# EAGLE design 3002_arduino (EAGLE 9.6.2)
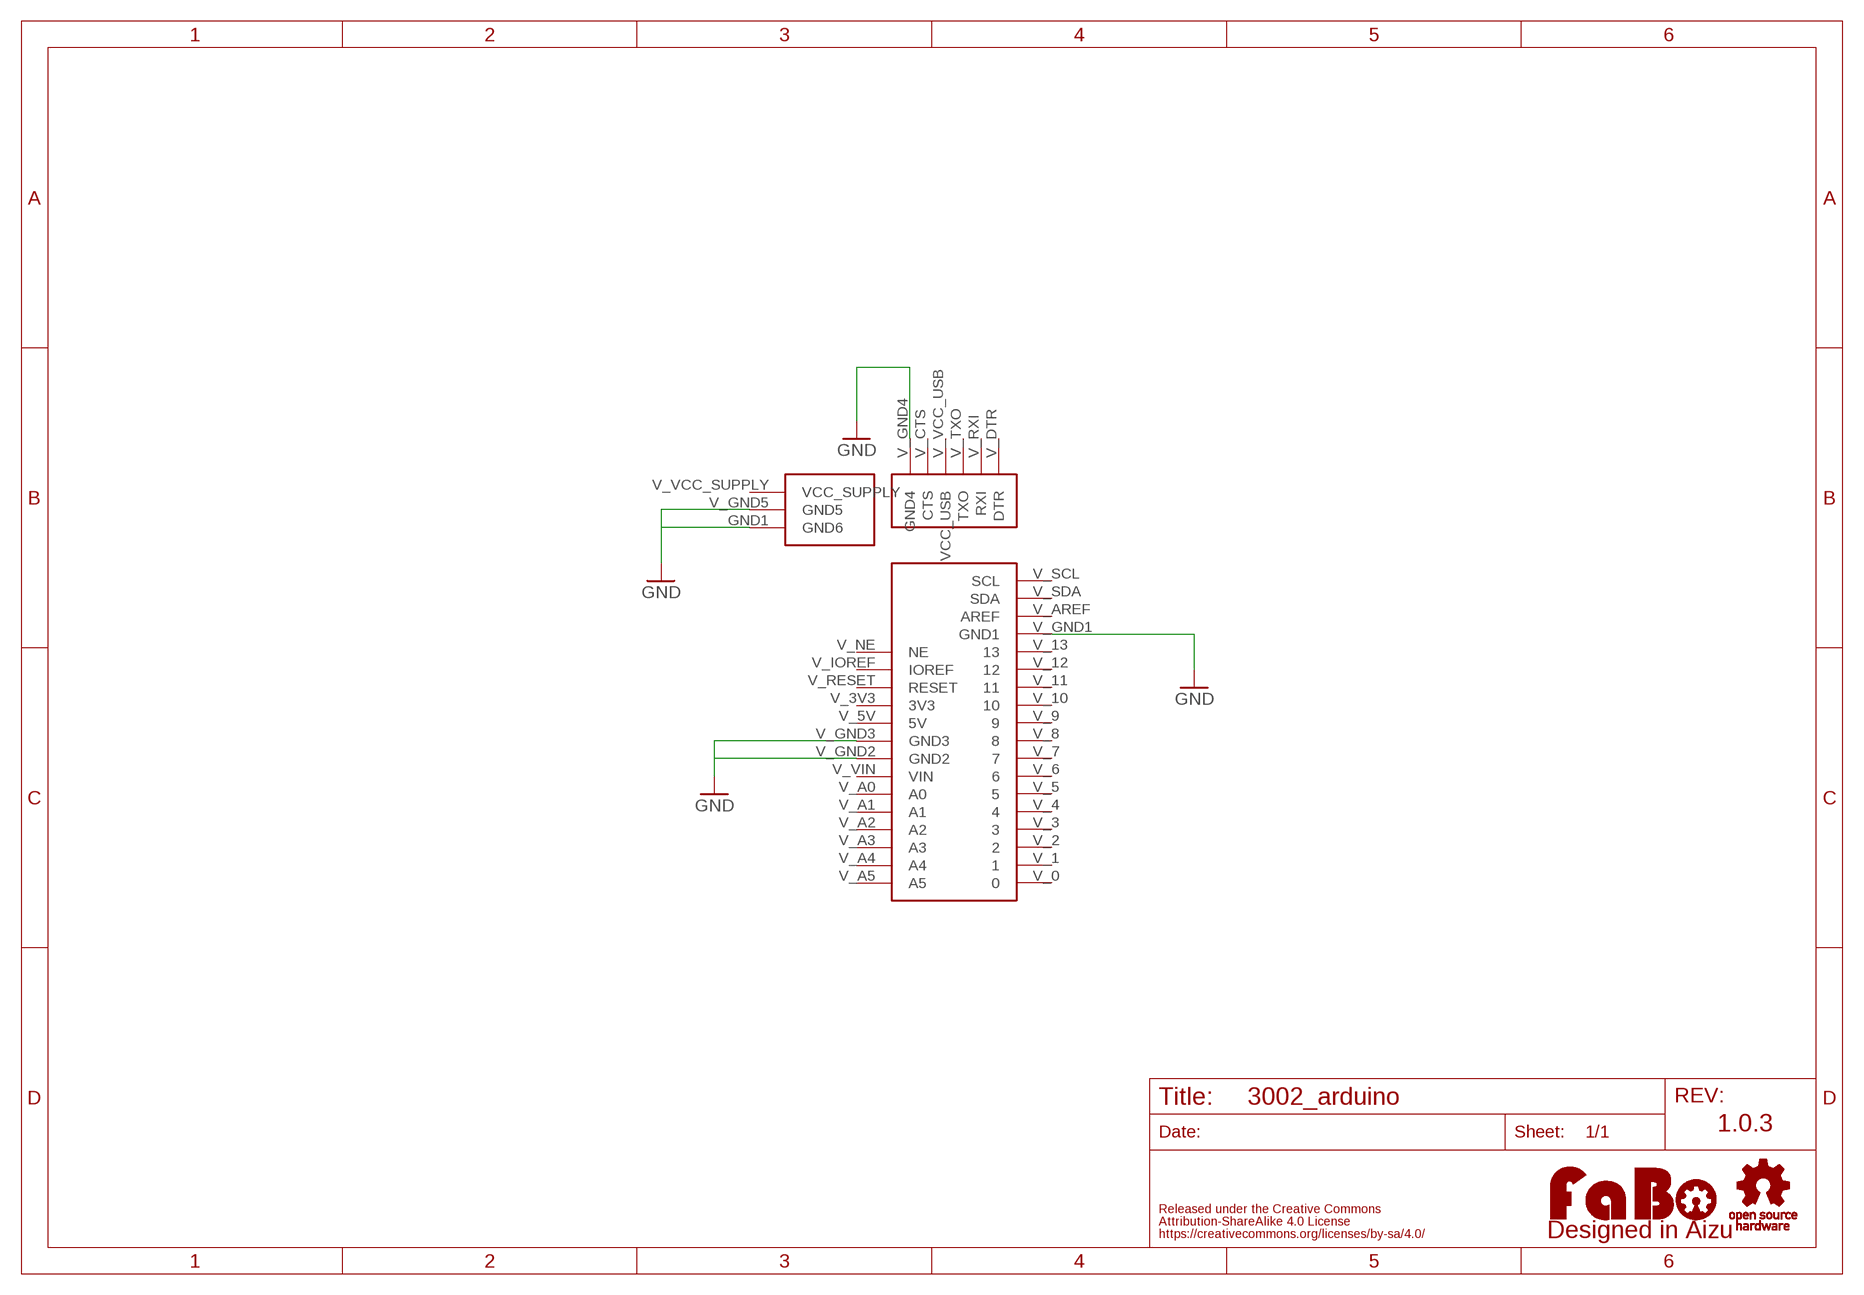
[diagram p0: schematic, sheet 1]

## Parts
U$2  LOGO_OSHW-M_BOTTOM  [LOGO_OSHW_M_BOTTOM]
U$3  FABO-ARDUINO-VOLTERA-VOLTERA  [FABO-ARDUINO-VOLTERA]
U$4  LOGO_FABO-S  [LOGO_FABO_S]

## Nets
GND: U$3.GND1(GND6) U$3.V_GND1(GND1) U$3.V_GND2(GND2) U$3.V_GND3(GND3) U$3.V_GND4(GND4) U$3.V_GND5(GND5)
Unconnected: U$3.V_0 U$3.V_1 U$3.V_2 U$3.V_3 U$3.V_3V3(3V3) U$3.V_4 U$3.V_5 U$3.V_5V(5V) U$3.V_6 U$3.V_7 U$3.V_8 U$3.V_9 U$3.V_10 U$3.V_11 U$3.V_12 U$3.V_13 U$3.V_A0(A0) U$3.V_A1(A1) U$3.V_A2(A2) U$3.V_A3(A3) U$3.V_A4(A4) U$3.V_A5(A5) U$3.V_AREF(AREF) U$3.V_CTS(CTS) U$3.V_DTR(DTR) U$3.V_IOREF(IOREF) U$3.V_NE(NE) U$3.V_RESET(RESET) U$3.V_RXI(RXI) U$3.V_SCL(SCL) U$3.V_SDA(SDA) U$3.V_TXO(TXO) U$3.V_VCC_SUPPLY(VCC_SUPPLY) U$3.V_VCC_USB(VCC_USB) U$3.V_VIN(VIN)

## Notes on the sheet
- 1.0.3

## Library data of the parts
U$2 = FaBo-Logo:LOGO_OSHW
U$3 = FaBo-Template:FABO-ARDUINO-VOLTERA
U$4 = FaBo-Logo:LOGO_FABO

## Board
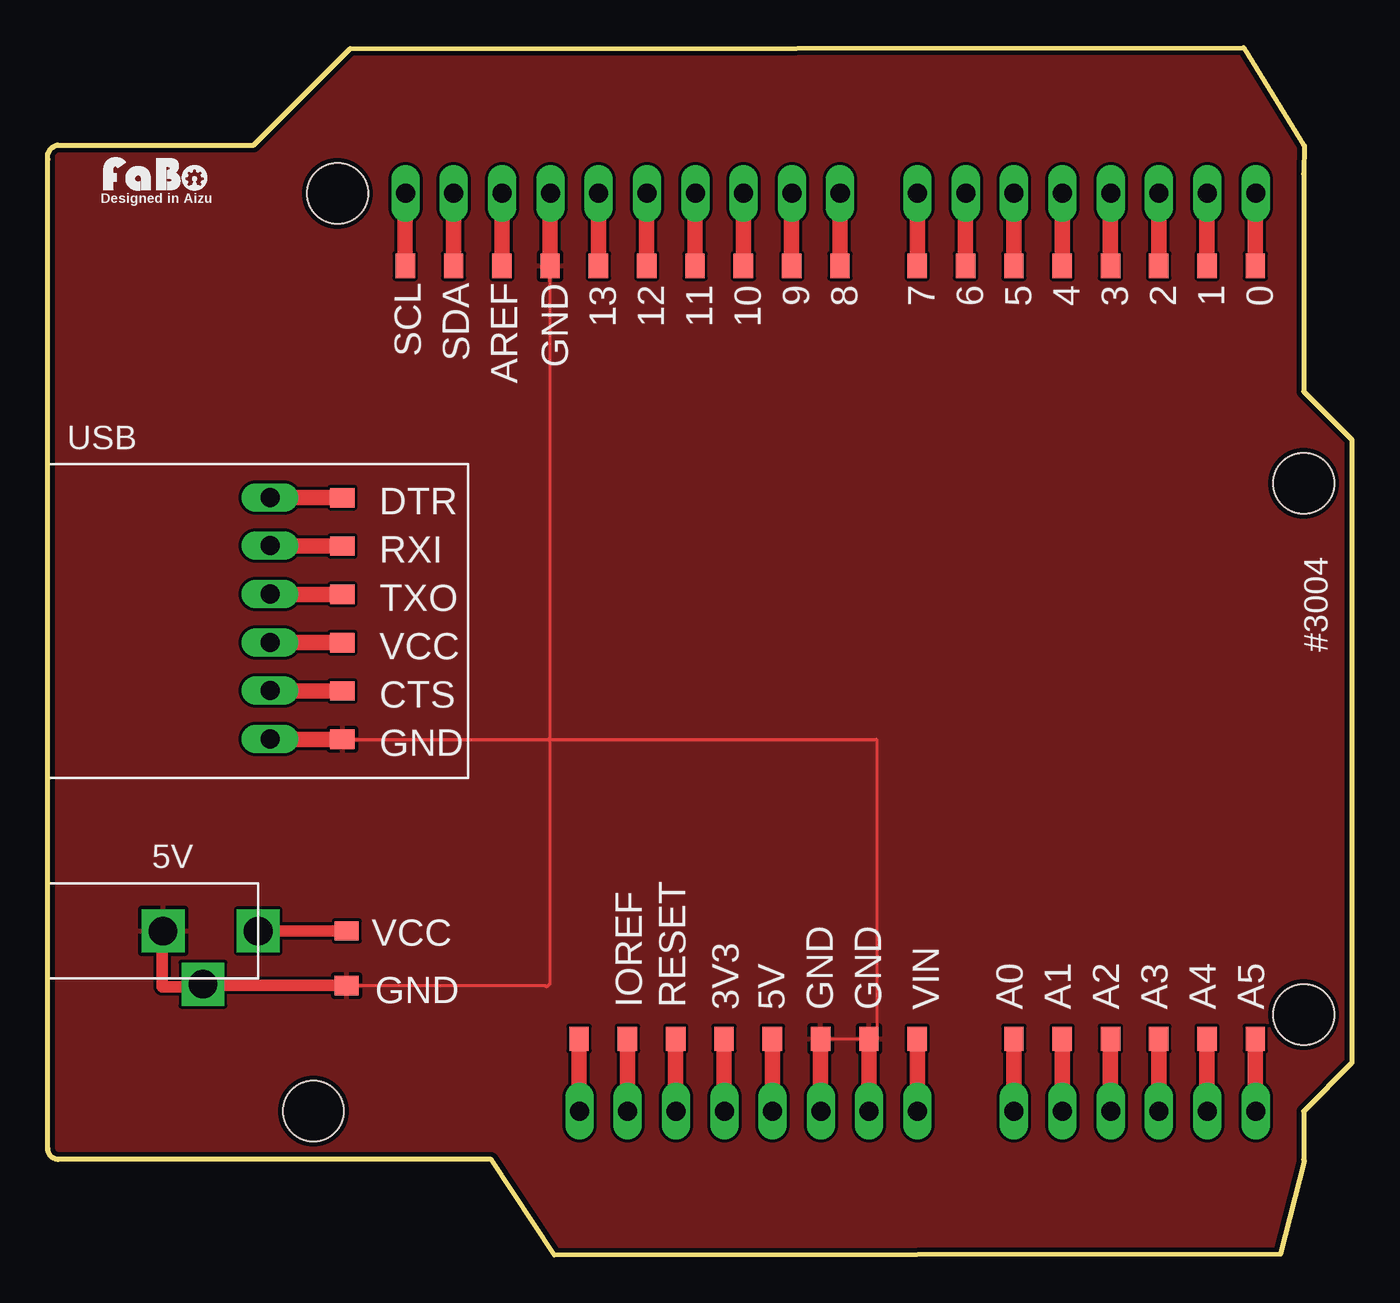
[diagram p1: board, top side]
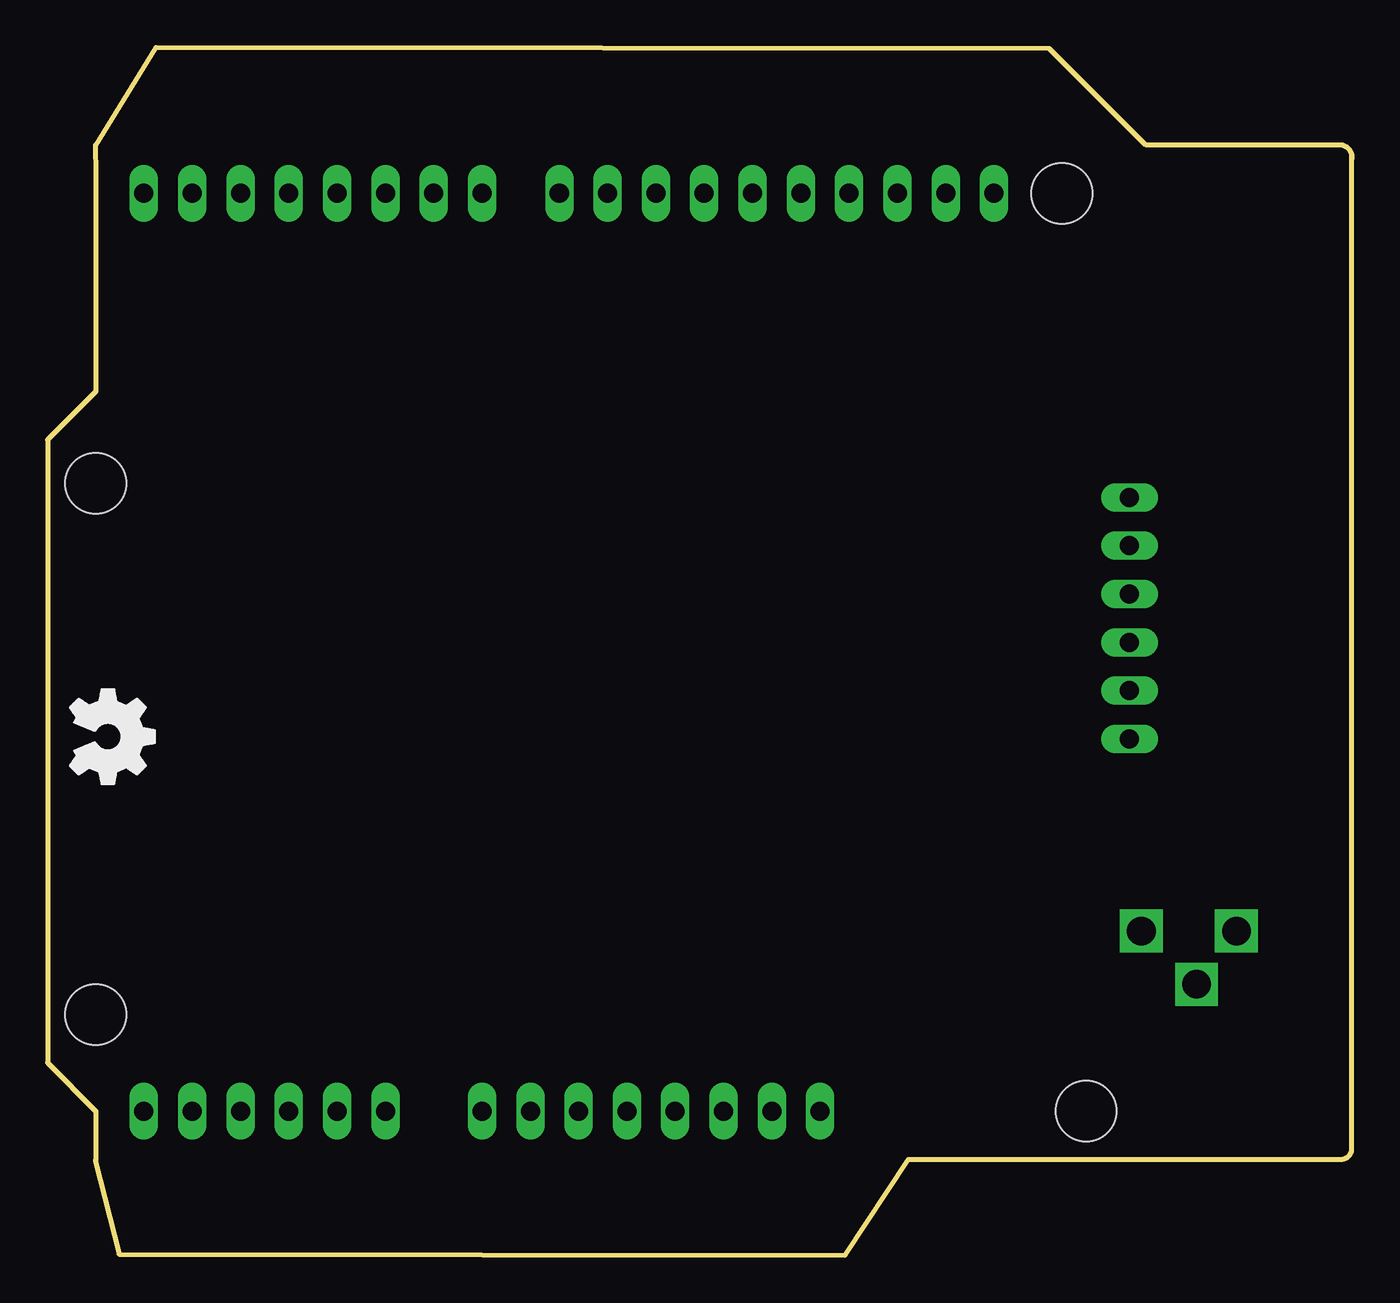
[diagram p2: board, bottom side, seen from below]

Size 68.59 x 63.5 mm. Coordinates in mm from the lower left corner, seen from the top.
Copper layers (1*16): Top 0.035mm / dielectric 1.6mm / Bottom 0.035mm
Design rules "PCBway": minimum track width 6mil, minimum drill 12mil, track to track 6mil, track to pad 6mil, pad to pad 6mil, via to via 6mil, smd to smd 6mil, copper to edge 10mil, drill to drill 10mil, minimum pad ring 10mil, minimum via ring 6mil, stop-mask expansion 2mil, vias tented up to drill 100mil, thermal gap 8mil

### Footprints (pad centres in the part's own frame; a part is rotated, then mirrored left to right if it is on the bottom)
FABO-ARDUINO-VOLTERA = drill 1.5 square: GND1 -29.497,-14.656; GND2 -27.397,-17.456; VCC -24.497,-14.656 | drill 1 pad 1.422 long: P$1 -9.131,24.13; P$2 -6.591,24.13; P$3 -11.671,24.13; P$4 -4.051,24.13; P$5 -1.511,24.13; P$6 1.029,24.13; P$7 3.569,24.13; P$8 6.109,24.13; P$9 10.173,24.13; P$10 12.713,24.13; P$11 15.253,24.13; P$12 17.793,24.13; P$13 20.333,24.13; P$14 22.873,24.13; P$15 25.413,24.13; P$16 27.953,24.13; P$17 -2.527,-24.13; P$18 0.013,-24.13; P$19 2.553,-24.13; P$20 5.093,-24.13; P$21 7.633,-24.13; P$22 10.173,-24.13; P$23 15.253,-24.13; P$24 17.793,-24.13; P$25 20.333,-24.13; P$26 22.873,-24.13; P$27 25.413,-24.13; P$28 27.953,-24.13; P$29 -23.876,0.521; P$30 -23.876,-2.019; P$31 -23.876,-4.559; P$32 -23.876,3.061; P$33 -23.876,5.601; P$34 -23.876,8.141; P$35 -14.211,24.13; P$36 -16.751,24.13; P$37 -5.067,-24.13; P$38 -7.607,-24.13 | smd 1.016 x 1.27: V_0 27.94,20.32; V_1 25.4,20.32; V_2 22.86,20.32; V_3 20.32,20.32; V_3V3 0,-20.32; V_4 17.78,20.32; V_5 15.24,20.32; V_5V 2.54,-20.32; V_6 12.7,20.32; V_7 10.16,20.32; V_8 6.096,20.32; V_9 3.556,20.32; V_10 1.016,20.32; V_11 -1.524,20.32; V_12 -4.064,20.32; V_13 -6.604,20.32; V_A0 15.24,-20.32; V_A1 17.78,-20.32; V_A2 20.32,-20.32; V_A3 22.86,-20.32; V_A4 25.4,-20.32; V_A5 27.94,-20.32; V_AREF -11.684,20.32; V_GND1 -9.144,20.32; V_GND2 7.62,-20.32; V_GND3 5.08,-20.32; V_IOREF -5.08,-20.32; V_NE -7.62,-20.32; V_RESET -2.54,-20.32; V_SCL -16.764,20.32; V_SDA -14.224,20.32; V_VIN 10.16,-20.32 | smd 1.27 x 1.016: V_CTS -20.066,-2.032; V_DTR -20.066,8.128; V_GND4 -20.066,-4.572; V_GND5 -19.837,-17.526; V_RXI -20.066,5.588; V_TXO -20.066,3.048; V_VCC_SUPPLY -19.837,-14.656; V_VCC_USB -20.066,0.508 | hole 3.2: 30.48,8.89; 30.48,-19.05; -20.32,24.13; -21.59,-24.13

### Placement (x,y rotation side)
U$2  65.42,27.25 90 top
U$3  35.57,31.7 0 top
U$4  5.73,55.83 0 top

### Tracks (layer width: path | path; a pad name or v marks a point on that pad's centre or on a via)
GND
  Top 0.152: U$3.V_GND1 arc90 26.41,52 26.41,27.13 | U$3.V_GND4 26.31,27.13 | 26.31,27.13 26.41,27.13 arc90 26.41,27.13 | U$3.V_GND5 26.17,14.17 arc-90 26.21,14.13 arc90 26.41,14.33 26.41,27.13 | 43.61,27.09 43.61,11.8 arc-90 U$3.V_GND2 U$3.V_GND3 | 43.61,27.09 43.61,27.13 | 26.31,27.13 43.57,27.13 arc-90 43.61,27.09
  pour Top: 0.01,-0.05 68.59,-0.05 68.59,63.45 0.01,63.45

### Text on the board
tPlace: Designed in Aizu | #3004